# EAGLE board thermo_final (EAGLE 9.6.2)
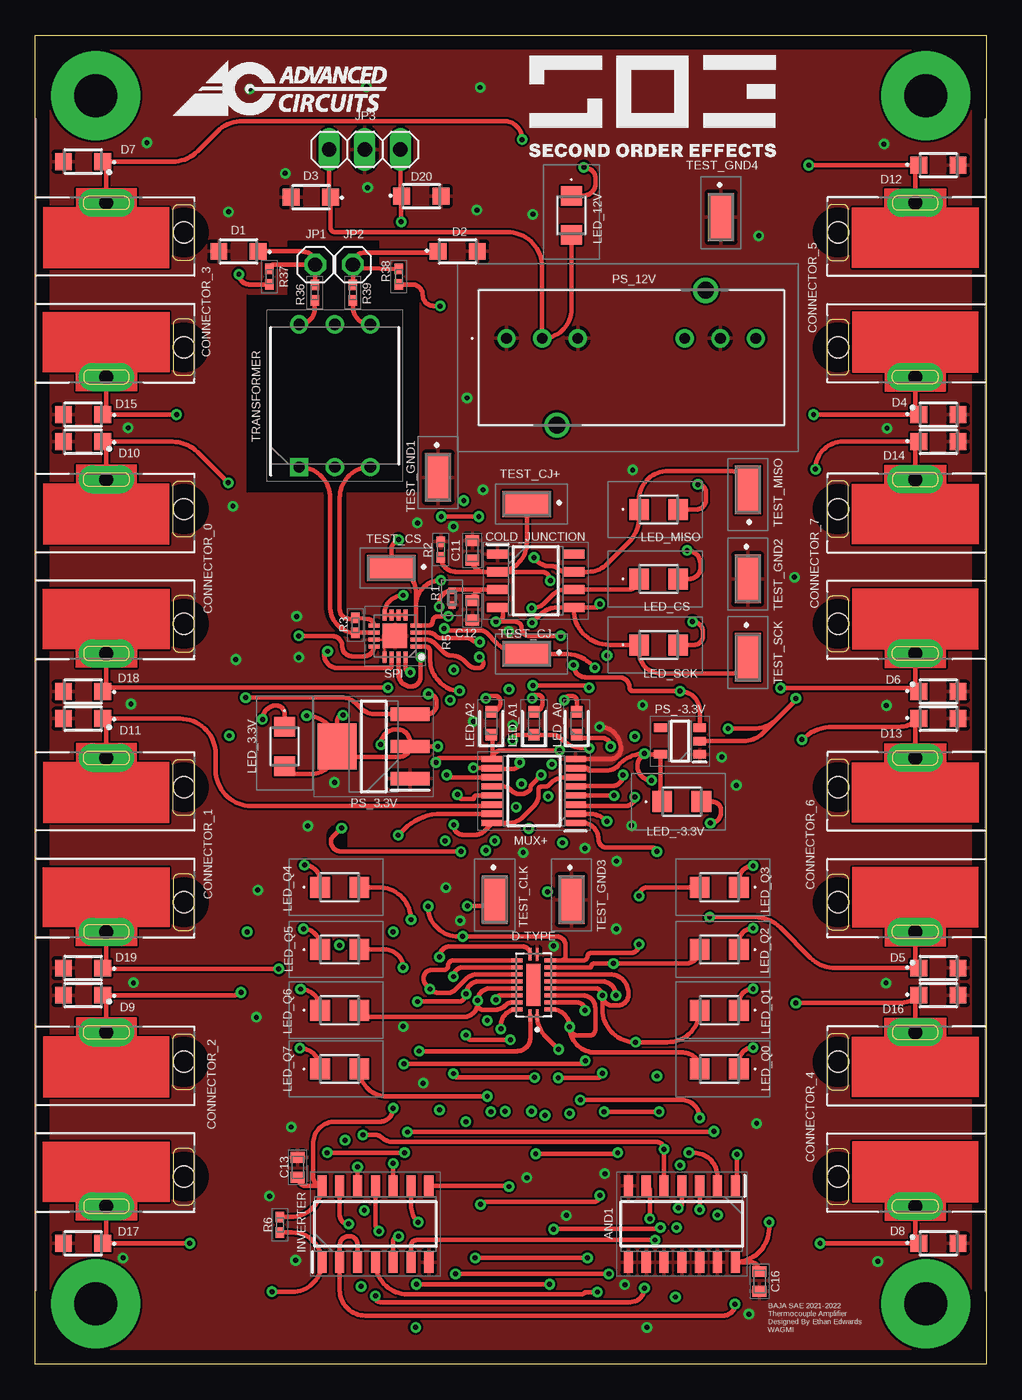
[diagram p2: board, top side]
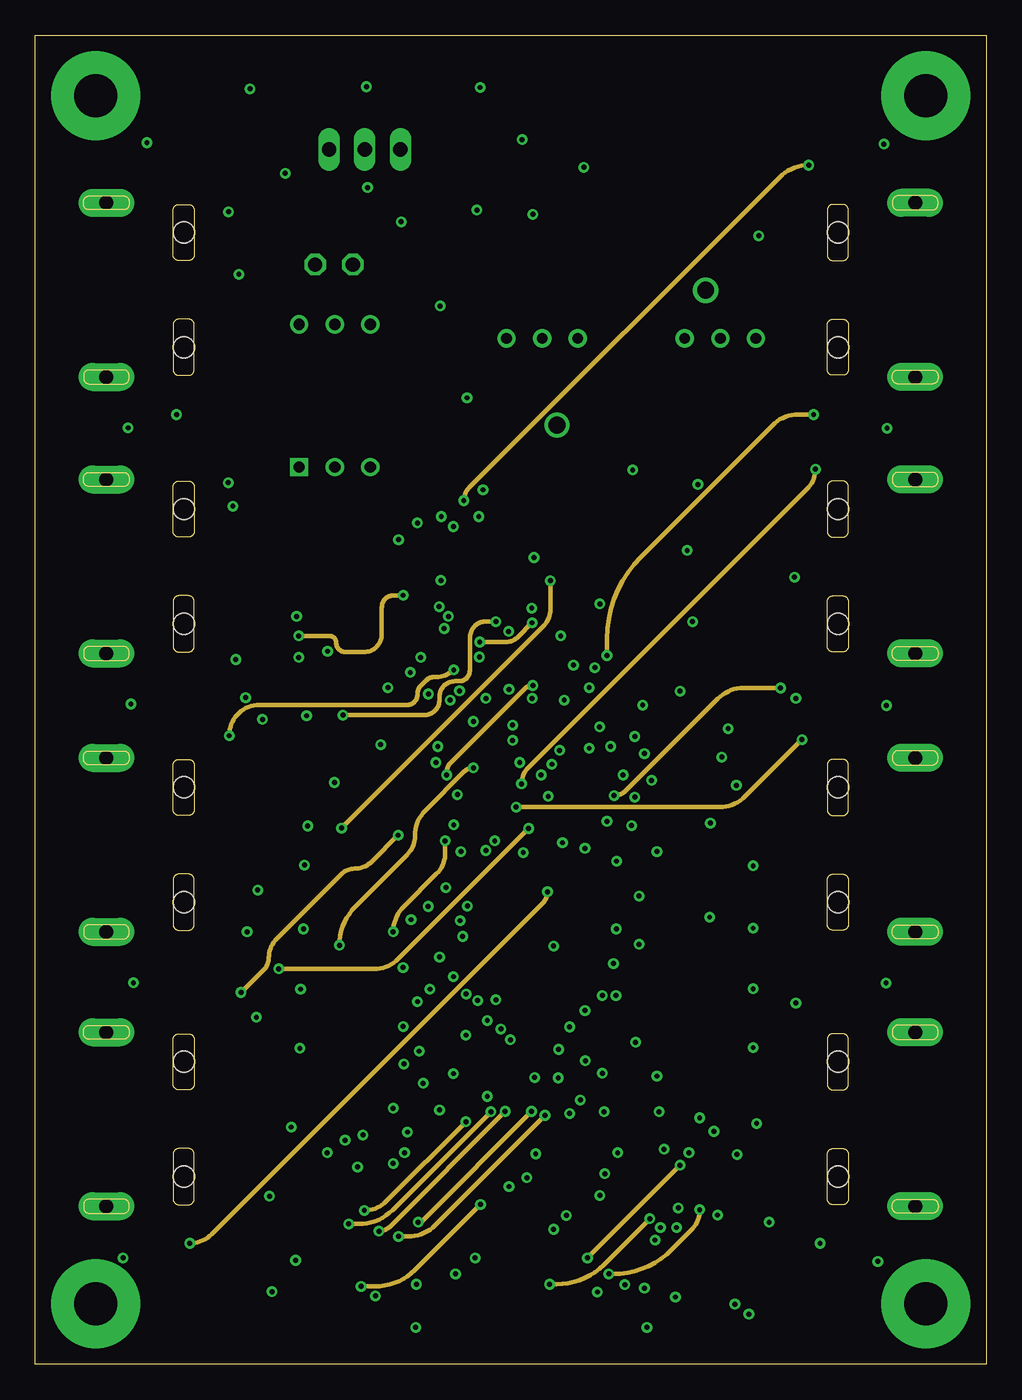
[diagram p3: board, inner layer Route2]
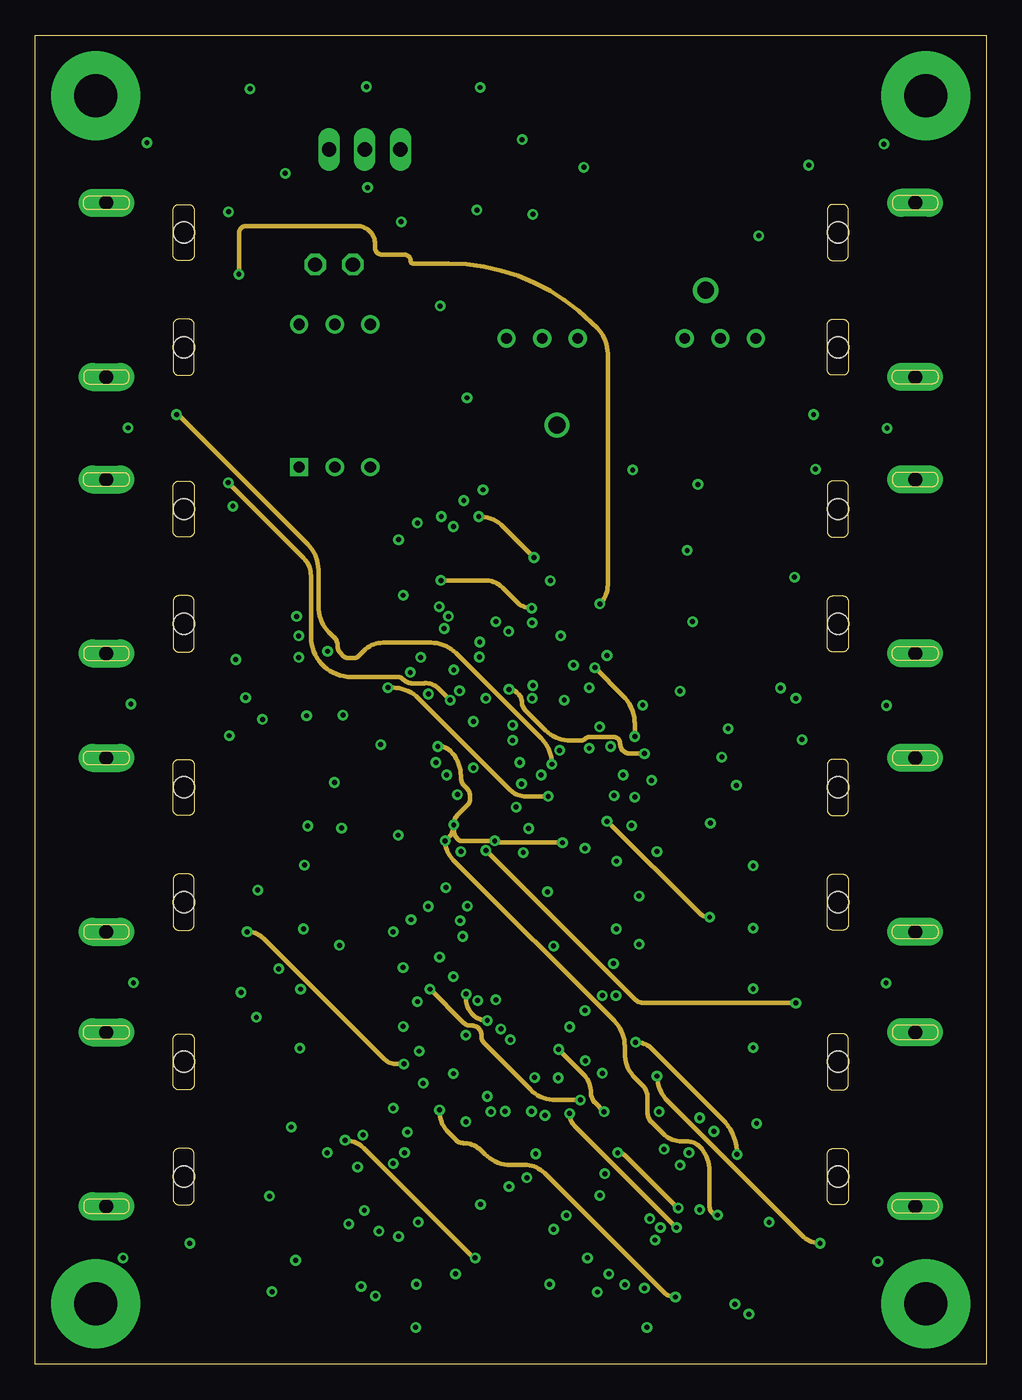
[diagram p4: board, inner layer Route15]
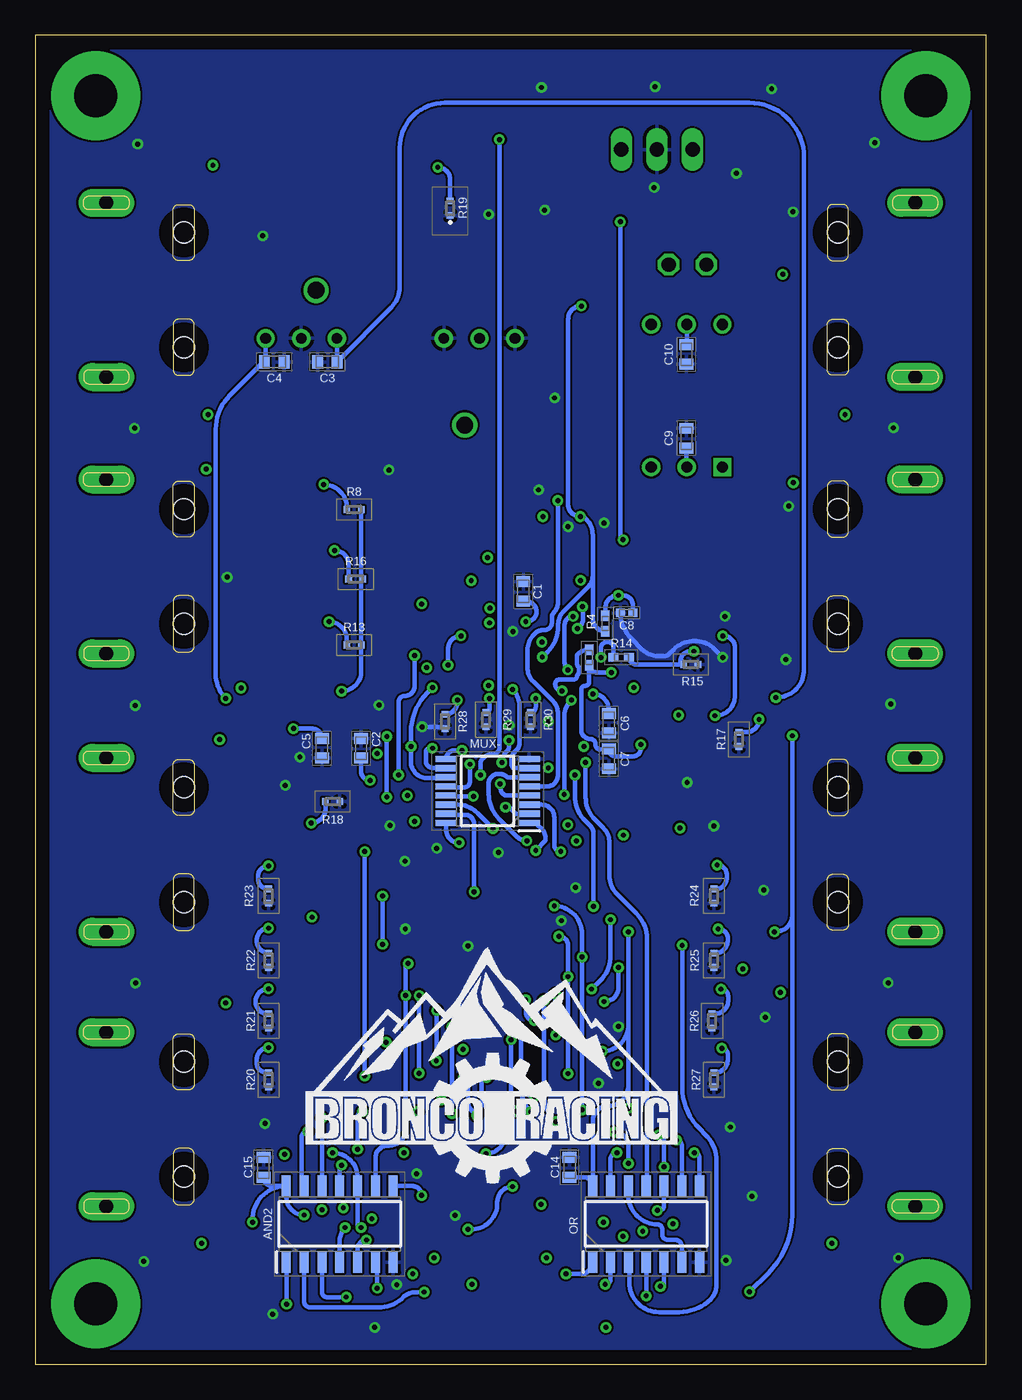
[diagram p5: board, bottom side, seen from below]

Size 67.82 x 94.74 mm. Coordinates in mm from the lower left corner, seen from the top.
Outline: 0,94.74 67.82,94.74 67.82,0 0,0 0,94.74
Copper layers (1+2*15+16): Top 0.035mm / dielectric 0.2mm / Route2 0.0175mm / dielectric 1.065mm / Route15 0.0175mm / dielectric 0.2mm / Bottom 0.035mm
Design rules "default *": minimum track width 6mil, minimum drill 0.35mm, track to track 6mil, track to pad 6mil, pad to pad 6mil, via to via 6mil, smd to smd 6mil, copper to edge 40mil, drill to drill 6mil, minimum pad ring 10mil, minimum via ring 8mil, stop-mask expansion 4mil, vias tented up to drill 20mil, thermal gap 10mil

## Footprints (pad centres in the part's own frame; a part is rotated, then mirrored left to right if it is on the bottom)
SOIC127P600X175-14N = smd 1.525 x 0.65: 1 -2.712,3.81; 2 -2.712,2.54; 3 -2.712,1.27; 4 -2.712,0; 5 -2.712,-1.27; 6 -2.712,-2.54; 7 -2.712,-3.81; 8 2.712,-3.81; 9 2.712,-2.54; 10 2.712,-1.27; 11 2.712,0; 12 2.712,1.27; 13 2.712,2.54; 14 2.712,3.81
CAPC1608X90N = smd 0.78 x 0.99: 1 -0.7,0; 2 0.7,0
CAPC1005X55N = smd 0.65 x 0.62: 1 -0.44,0; 2 0.44,0
SOIC127P600X175-8N = smd 1.525 x 0.65: 1 -2.712,1.905; 2 -2.712,0.635; 3 -2.712,-0.635; 4 -2.712,-1.905; 5 2.712,-1.905; 6 2.712,-0.635; 7 2.712,0.635; 8 2.712,1.905
OMEGA_PCC-SMD-20 = drill 1 pad 2 long: 1 -6.2,0; 2 6.2,0 | hole 1.5: -4.09,5.515; 4.09,5.515
SOD123W = smd 1.2 x 1.2: 1 -1.4,0; 2 1.4,0
QFN50P450X250X100-21N = smd 0.26 x 0.86: 1 -0.25,2.185; 10 -0.25,-2.185; 11 0.25,-2.185; 20 0.25,2.185 | smd 0.86 x 0.26: 2 -1.185,1.75; 3 -1.185,1.25; 4 -1.185,0.75; 5 -1.185,0.25; 6 -1.185,-0.25; 7 -1.185,-0.75; 8 -1.185,-1.25; 9 -1.185,-1.75; 12 1.185,-1.75; 13 1.185,-1.25; 14 1.185,-0.75; 15 1.185,-0.25; 16 1.185,0.25; 17 1.185,0.75; 18 1.185,1.25; 19 1.185,1.75 | smd 1 x 3: 21 0,0
1X01 = drill 1.016 octagon: 1 0,0
1X03 = drill 1.016 long: 1 -2.54,0; 2 0,0; 3 2.54,0
AA3021LSYSKJ3TR = smd 1.4 x 1.5: 1 -1.4,0; 2 1.4,0
APT1608CGCK = smd 0.8 x 0.8: 1 -0.825,0; 2 0.825,0
SOP65P640X120-16N = smd 1.525 x 0.45: 1 -2.962,2.275; 2 -2.962,1.625; 3 -2.962,0.975; 4 -2.962,0.325; 5 -2.962,-0.325; 6 -2.962,-0.975; 7 -2.962,-1.625; 8 -2.962,-2.275; 9 2.962,-2.275; 10 2.962,-1.625; 11 2.962,-0.975; 12 2.962,-0.325; 13 2.962,0.325; 14 2.962,0.975; 15 2.962,1.625; 16 2.962,2.275
SOT230P700X180-4N = smd 2.75 x 0.95: 1 -2.6,2.3; 2 -2.6,0; 3 -2.6,-2.3 | smd 2.75 x 3.25: 4 2.6,0
TMR67212WIR = drill 0.76 pad 1.303: 1 0,0; 2 2.54,0; 3 5.08,0; 6 12.7,0; 7 15.24,0; 8 17.78,0 | drill 1.2 pad 1.8: C1 3.59,-6.175; C2 14.19,3.425
SOT95P280X130-5N = smd 0.9 x 0.6: 1 -1.4,0.95; 2 -1.4,0; 3 -1.4,-0.95; 4 1.4,-0.95; 5 1.4,0.95
ERA2AED122X = smd 0.475 x 0.5: 1 -0.512,0; 2 0.512,0
RESC1005X40N = smd 0.75 x 0.6: 1 -0.55,0; 2 0.55,0
RESC1005X35N = smd 0.7 x 0.6: 1 -0.55,0; 2 0.55,0
ERJ2R_(0402) = smd 0.475 x 0.5: 1 -0.512,0; 2 0.512,0
QFN50P300X300X80-17N = smd 0.8 x 0.3: 1 -1.5,0.75; 2 -1.5,0.25; 3 -1.5,-0.25; 4 -1.5,-0.75; 9 1.5,-0.75; 10 1.5,-0.25; 11 1.5,0.25; 12 1.5,0.75 | smd 0.3 x 0.8: 5 -0.75,-1.5; 6 -0.25,-1.5; 7 0.25,-1.5; 8 0.75,-1.5; 13 0.75,1.5; 14 0.25,1.5; 15 -0.25,1.5; 16 -0.75,1.5 | smd 1.75 x 1.75: 17 0,0
S175146R = smd 3.45 x 1.85: 1 0,0
DIP1016W60P254L914H635Q6N = drill 0.8 pad 1.2 square: 1 -5.08,2.54 | drill 0.8 pad 1.2: 2 -5.08,0; 3 -5.08,-2.54; 4 5.08,-2.54; 5 5.08,0; 6 5.08,2.54
THROUGH_HOLE = drill 3.048 pad 6.35: THROUGH_HOLE 0,0

## Placement (x,y rotation side)
AND1  AND1  [SOIC127P600X175-14N]  46.1,10.01 270 top
AND2  AND2  [SOIC127P600X175-14N]  46.1,10.01 90 bottom
C1  0.1uF  [CAPC1608X90N]  33.02,55.09 270 bottom
C2  1uF  [CAPC1608X90N]  44.58,43.92 90 bottom
C3  4.7uF  [CAPC1608X90N]  46.99,71.45 0 bottom
C4  4.7uF  [CAPC1608X90N]  50.77,71.45 180 bottom
C5  1uF  [CAPC1608X90N]  47.37,43.92 270 bottom
C6  1uF  [CAPC1608X90N]  26.92,45.69 90 bottom
C7  4.7uF  [CAPC1608X90N]  26.92,43.15 90 bottom
C8  0.01uF  [CAPC1005X55N]  25.65,53.57 180 bottom
C9  27pF  [CAPC1608X90N]  21.39,66.01 270 bottom
C10  27pF  [CAPC1608X90N]  21.39,71.98 270 bottom
C11  06035C270JAT2A  [CAPC1608X90N]  31.17,58.01 270 top
C12  06035C270JAT2A  [CAPC1608X90N]  31.17,53.75 270 top
C13  0.1uF  [CAPC1608X90N]  18.72,14.05 270 top
C14  0.1uF  [CAPC1608X90N]  29.72,14.05 270 bottom
C15  0.1uF  [CAPC1608X90N]  51.54,14.05 270 bottom
C16  0.1uF  [CAPC1608X90N]  51.64,5.92 90 top
COLD_JUNCTION  MAX6675ISA+  [SOIC127P600X175-8N]  35.69,55.85 0 top
CONNECTOR_0  PCC-SMD-20  [OMEGA_PCC-SMD-20]  5.08,56.87 270 top
CONNECTOR_1  PCC-SMD-20  [OMEGA_PCC-SMD-20]  5.08,37.03 270 top
CONNECTOR_2  PCC-SMD-20  [OMEGA_PCC-SMD-20]  5.08,17.48 270 top
CONNECTOR_3  PCC-SMD-20  [OMEGA_PCC-SMD-20]  5.08,76.58 270 top
CONNECTOR_4  PCC-SMD-20  [OMEGA_PCC-SMD-20]  62.74,17.48 90 top
CONNECTOR_5  PCC-SMD-20  [OMEGA_PCC-SMD-20]  62.74,76.58 90 top
CONNECTOR_6  PCC-SMD-20  [OMEGA_PCC-SMD-20]  62.74,37.03 90 top
CONNECTOR_7  PCC-SMD-20  [OMEGA_PCC-SMD-20]  62.74,56.87 90 top
D1  PTVS12VS1UR,115  [SOD123W]  14.5,79.32 180 top
D2  PTVS12VS1UR,115  [SOD123W]  30.12,79.32 0 top
D3  PTVS12VS1UR,115  [SOD123W]  19.66,83.19 180 top
D4  PTVS12VS1UR,115  [SOD123W]  64.39,67.69 0 top
D5  PTVS12VS1UR,115  [SOD123W]  64.39,28.24 0 top
D6  PTVS12VS1UR,115  [SOD123W]  64.39,47.96 0 top
D7  PTVS12VS1UR,115  [SOD123W]  3.43,85.72 180 top
D8  PTVS12VS1UR,115  [SOD123W]  64.39,8.64 0 top
D9  PTVS12VS1UR,115  [SOD123W]  3.43,26.31 180 top
D10  PTVS12VS1UR,115  [SOD123W]  3.43,65.76 180 top
D11  PTVS12VS1UR,115  [SOD123W]  3.43,46.02 180 top
D12  PTVS12VS1UR,115  [SOD123W]  64.39,85.47 0 top
D13  PTVS12VS1UR,115  [SOD123W]  64.39,46.02 0 top
D14  PTVS12VS1UR,115  [SOD123W]  64.39,65.76 0 top
D15  PTVS12VS1UR,115  [SOD123W]  3.43,67.69 180 top
D16  PTVS12VS1UR,115  [SOD123W]  64.39,26.31 0 top
D17  PTVS12VS1UR,115  [SOD123W]  3.43,8.64 180 top
D18  PTVS12VS1UR,115  [SOD123W]  3.43,47.96 180 top
D19  PTVS12VS1UR,115  [SOD123W]  3.43,28.24 180 top
D20  PTVS12VS1UR,115  [SOD123W]  27.53,83.26 0 top
D-TYPE  D-type  [QFN50P450X250X100-21N]  35.53,27.05 180 top
INVERTER  INVERTER  [SOIC127P600X175-14N]  24.26,10.01 90 top
JP1  [1X01]  19.96,78.38 0 top
JP2  [1X01]  22.66,78.38 0 top
JP3  [1X03]  23.5,86.59 0 top
LED_3.3V  AA3021LSYSK_J3-TR  [AA3021LSYSKJ3TR]  17.78,44.04 270 top
LED_12V  AA3021LSYSK_J3-TR  [AA3021LSYSKJ3TR]  38.23,81.89 270 top
LED_-3.3V  AA3021LSYSK_J3-TR  [AA3021LSYSKJ3TR]  46.1,40.11 0 top
LED_A0  APTD1608LCGCK  [APT1608CGCK]  38.61,45.69 90 top
LED_A1  APTD1608LCGCK  [APT1608CGCK]  35.56,45.69 90 top
LED_A2  APTD1608LCGCK  [APT1608CGCK]  32.51,45.69 90 top
LED_CS  AA3021LSYSK_J3-TR  [AA3021LSYSKJ3TR]  44.45,55.98 0 top
LED_MISO  AA3021LSYSK_J3-TR  [AA3021LSYSKJ3TR]  44.45,60.93 0 top
LED_Q0  AA3021LSYSK_J3-TR  [AA3021LSYSKJ3TR]  48.77,21.06 180 top
LED_Q1  AA3021LSYSK_J3-TR  [AA3021LSYSKJ3TR]  48.77,25.25 180 top
LED_Q2  AA3021LSYSK_J3-TR  [AA3021LSYSKJ3TR]  48.77,29.57 180 top
LED_Q3  AA3021LSYSK_J3-TR  [AA3021LSYSKJ3TR]  48.77,34.01 180 top
LED_Q4  AA3021LSYSK_J3-TR  [AA3021LSYSKJ3TR]  21.72,34.01 0 top
LED_Q5  AA3021LSYSK_J3-TR  [AA3021LSYSKJ3TR]  21.72,29.57 0 top
LED_Q6  AA3021LSYSK_J3-TR  [AA3021LSYSKJ3TR]  21.72,25.25 0 top
LED_Q7  AA3021LSYSK_J3-TR  [AA3021LSYSKJ3TR]  21.72,21.06 0 top
LED_SCK  AA3021LSYSK_J3-TR  [AA3021LSYSKJ3TR]  44.45,51.28 0 top
MUX+  DG4051EEQ-T1-GE3  [SOP65P640X120-16N]  35.56,40.87 180 top
MUX-  DG4051EEQ-T1-GE3  [SOP65P640X120-16N]  35.56,40.87 180 bottom
OR  OR  [SOIC127P600X175-14N]  24.26,10.01 90 bottom
PS_3.3V  LDL1117S33R  [SOT230P700X180-4N]  24.13,44.04 180 top
PS_12V  TMR_6-2422WIR  [TMR67212WIR]  33.6,73.13 0 top
PS_-3.3V  XC6901D331MR-G  [SOT95P280X130-5N]  45.97,44.42 180 top
R1  5.6K  [ERA2AED122X]  29.72,54.64 270 top
R2  CRG0402ZR  [RESC1005X40N]  28.93,58.09 90 top
R3  100  [RESC1005X40N]  22.83,52.68 270 top
R4  3.3K  [RESC1005X40N]  27.18,52.81 90 bottom
R5  3.3K  [RESC1005X40N]  28.32,50.39 90 bottom
R6  RC0402FR-0793K1L  [RESC1005X40N]  17.45,9.96 270 top
R8  ERA-2ARB562X  [ERA2AED122X]  45.09,60.93 180 bottom
R13  ERA-2ARB562X  [ERA2AED122X]  45.09,51.28 180 bottom
R14  1.21K  [RESC1005X35N]  26.04,50.39 0 bottom
R15  787  [ERA2AED122X]  21.08,49.89 0 bottom
R16  ERA-2ARB562X  [ERA2AED122X]  44.96,55.98 180 bottom
R17  ERA-2ARB562X  [ERA2AED122X]  17.65,44.55 90 bottom
R18  ERA-2ARB562X  [ERA2AED122X]  46.61,40.11 180 bottom
R19  ERJ-2RKF2002X  [ERJ2R_(0402)]  38.23,82.4 90 bottom
R20  ERA-2ARB562X  [ERA2AED122X]  51.18,20.29 90 bottom
R21  ERA-2ARB562X  [ERA2AED122X]  51.18,24.49 90 bottom
R22  ERA-2ARB562X  [ERA2AED122X]  51.18,28.8 90 bottom
R23  ERA-2ARB562X  [ERA2AED122X]  51.18,33.38 90 bottom
R24  ERA-2ARB562X  [ERA2AED122X]  19.43,33.38 90 bottom
R25  ERA-2ARB562X  [ERA2AED122X]  19.43,28.8 90 bottom
R26  ERA-2ARB562X  [ERA2AED122X]  19.56,24.49 90 bottom
R27  ERA-2ARB562X  [ERA2AED122X]  19.43,20.29 90 bottom
R28  ERA-2ARB562X  [ERA2AED122X]  38.61,45.82 90 bottom
R29  ERA-2ARB562X  [ERA2AED122X]  35.69,45.95 90 bottom
R30  ERA-2ARB562X  [ERA2AED122X]  32.51,45.95 90 bottom
R36  CRG0402ZR  [RESC1005X40N]  19.94,76.38 270 top
R37  CRG0402ZR  [RESC1005X40N]  16.71,77.52 270 top
R38  CRG0402ZR  [RESC1005X40N]  25.93,77.52 270 top
R39  CRG0402ZR  [RESC1005X40N]  22.66,76.38 90 top
SPI  LTC6820IUD#PBF  [QFN50P300X300X80-17N]  25.65,51.92 180 top
TEST_CJ+  S1751-46R  [S175146R]  35.05,61.32 0 top
TEST_CJ-  S1751-46R  [S175146R]  35.05,50.65 0 top
TEST_CLK  S1751-46R  [S175146R]  32.77,33.12 90 top
TEST_CS  S1751-46R  [S175146R]  25.4,56.74 0 top
TEST_GND1  S1751-46R  [S175146R]  28.73,63.22 90 top
TEST_GND2  S1751-46R  [S175146R]  50.8,55.98 90 top
TEST_GND3  S1751-46R  [S175146R]  38.23,33.12 90 top
TEST_GND4  S1751-46R  [S175146R]  48.9,81.76 90 top
TEST_MISO  S1751-46R  [S175146R]  50.8,62.33 270 top
TEST_SCK  S1751-46R  [S175146R]  50.8,50.39 90 top
TRANSFORMER  782482_33VC  [DIP1016W60P254L914H635Q6N]  21.36,69.04 90 top
U$1  THROUGH_HOLE  [THROUGH_HOLE]  4.32,90.42 0 top
U$2  THROUGH_HOLE  [THROUGH_HOLE]  4.32,4.32 0 top
U$3  THROUGH_HOLE  [THROUGH_HOLE]  63.5,4.32 0 top
U$4  THROUGH_HOLE  [THROUGH_HOLE]  63.5,90.42 0 top

## Tracks (layer width: path | path; a pad name or v marks a point on that pad's centre or on a via)
!CS  (via drill 0.35)
  Top 0.305: v49.89,4.29 arc-90 49.07,3.48 23.52,3.48 arc-90 21.72,5.28 INVERTER.2 21.72,8.48 arc-90 22.38,9.14 arc-90 22.99,8.53 INVERTER.3
  Bottom 0.305: v49.89,4.29 49.89,7.27 arc-90 AND2.1
!CS2  (via drill 0.35)
  Top 0.305: v40.08,5.16 39.29,5.16 arc45 39.17,5.11 arc-45 38.92,5 26.55,5 arc-90 INVERTER.4
  Bottom 0.305: AND2.2 48.64,4.5 arc-90 48.21,4.06 43.34,4.06 arc-45 41.55,4.81 arc45 40.71,5.16 v40.08,5.16
!Q1  (via drill 0.35)
  Top 0.305: INVERTER.6 26.8,8.48 arc-90 27.18,8.87 v44.2,8.87
  Bottom 0.305: v44.2,8.87 arc-90 44.83,8.23 AND2.5
!Q3  (via drill 0.35)
  Top 0.305: v33.78,12.68 33.74,12.72 INVERTER.8 | AND1.2 48.64,13.38 arc90 46.93,15.09 v46.61,15.09 | v44.58,9.75 arc-45 44.33,9.65 36.98,9.65 v36.96,9.63
  Bottom 0.305: v33.78,12.68 arc-90 34.87,11.58 34.87,11.48 arc90 36.73,9.63 v36.96,9.63 | v46.61,15.09 arc90 44.83,13.31 AND2.10 44.83,10.01 arc-90 v44.58,9.75
!Q5  (via drill 0.35)
  Top 0.305: v25.53,14.33 INVERTER.10 | v48.39,16.61 48.34,16.56 v26.54,16.56
  Bottom 0.305: v48.39,16.61 arc-90 48.82,16.18 48.82,12.9 AND2.13 | v26.54,16.56 arc90 25.53,15.54 v25.53,14.33
!Q7  (via drill 0.35)
  Top 0.305: AND1.5 v44.83,15.34 arc90 44.32,15.85 25.52,15.85 arc-45 24.66,16.2 arc45 24.3,16.36 v23.37,16.36 | v22.99,14.07 INVERTER.12 | v44.48,18.01 v40.56,18.01 | v37.31,22.45 36.41,23.36 arc-45 D-TYPE.1
  Route15 0.305: v40.56,18.01 39.91,18.66 arc-45 39.62,19.36 arc45 39.07,20.7 v37.31,22.45
  Bottom 0.305: v44.83,15.34 44.83,17.65 arc90 v44.48,18.01 | v23.37,16.36 arc90 22.99,15.98 v22.99,14.07
-VCC  (via drill 0.35)
  Top 0.305: PS_-3.3V.5 43.75,43.48 arc90 42.93,42.65 arc90 v43.94,41.63 | PS_-3.3V.5 44.57,40.41 arc45 LED_-3.3V.1 | PS_-3.3V.5 43.49,43.48 v43.43,43.54 arc45 41.7,42.82 41.53,42.65 arc-45 40.79,42.34 39.5,42.34 arc-90 39.42,42.42 arc90 39.34,42.49 MUX+.7
  Route15 0.305: v33.78,48.11 33.83,48.11 arc-45 34.31,47.9 34.48,47.74 arc-45 34.7,47.22 arc45 34.93,46.66 36.4,45.19 arc45 38.18,44.45 38.89,44.45 arc45 39.19,44.58 arc-45 39.56,44.73 41.2,44.73 arc-90 41.71,44.22 arc90 42.39,43.54 v43.43,43.54
  Bottom 0.305: v43.94,41.63 arc90 44.58,42.27 C2.1 | MUX-.7 33.73,42.49 arc45 33.86,42.8 33.86,43.08 arc45 33.61,43.69 33.45,43.84 arc-45 33.3,44.21 33.3,46.94 arc-45 v33.78,48.11
A1  (via drill 0.35)
  Top 0.305: v34.54,42.9 arc-90 34.09,42.44 32.6,42.44 32.57,42.48 | v34.04,44.48 arc-90 34.43,44.87 LED_A1.1 36.93,44.87 arc-45 37.39,44.68 37.47,44.6 arc45 39.05,43.94 39.44,43.94 arc-45 v39.5,43.92 | MUX+.10 arc45 32.64,42.48 32.57,42.48 | v31.24,42.52 32.52,42.52 arc90 32.57,42.48
  Route2 0.305: v31.24,42.52 arc45 30.59,42.25 27.82,39.48 arc45 27.08,37.68 27.08,37.67 arc-45 26.52,36.32 22.84,32.65 arc45 v21.69,29.87
  Bottom 0.305: v21.69,29.87 21.69,19.76 arc-45 20.47,16.82 20,16.34 arc45 19.25,14.54 19.25,5.63 arc45 19.66,4.65 arc45 21.88,3.73 23.37,3.73 arc90 25.45,5.82 25.45,7.22 arc-90 OR.3 | v34.04,44.48 34.04,44.01 arc45 34.14,43.76 34.22,43.68 arc-45 v34.54,42.9 | MUX-.10 39.36,42.49 arc45 39.85,42.7 arc45 39.95,42.94 39.95,43.64 arc90 39.67,43.92 v39.5,43.92
A2  (via drill 0.35)
  Top 0.305: MUX+.9 32.6,44.78 arc90 LED_A2.1 | MUX+.9 arc-90 33.22,43.76 v37.39,43.76 | v28.57,42.9 arc-90 28.89,43.22 32.41,43.22 arc-45 MUX+.9
  Bottom 0.305: v37.39,43.76 37.9,43.76 arc-90 MUX-.9 | v28.57,42.9 28.57,40.42 arc-45 27.92,38.84 27.3,38.23 arc45 26.87,37.19 26.87,34.82 arc-45 26.34,33.53 24.95,32.14 arc45 24.21,30.34 24.21,12.84 arc45 OR.11
CJ+  (via drill 0.35)
  Top 0.305: v39.9,49.66 39.73,49.84 arc45 37.76,50.65 35.2,50.65 TEST_CJ-.1 34.73,50.65 arc-45 32.94,51.39 32.18,52.15 arc45 31.81,52.3 29.53,52.3 arc-45 v29.16,52.45 | MUX+.3 arc90 38.61,39.8 42.11,39.8 arc90 v42.75,40.44 | v28.8,54 28.8,54.23 arc-90 R1.1 arc-90 29.79,55.22 COLD_JUNCTION.3 31.94,55.22 arc90 C12.1
  Route15 0.305: v42.75,44.76 42.75,45.63 arc45 41.91,47.65 v39.9,49.66
  Bottom 0.305: v42.75,44.76 v42.75,40.44 | v29.16,52.45 28.97,52.64 arc-45 28.75,53.16 28.75,53.95 arc-90 v28.8,54
CJ-  (via drill 0.35)
  Top 0.305: v30.35,36.55 21.82,36.55 arc-90 21.08,37.29 arc-45 21.21,37.59 v21.84,38.23 | v36.73,55.85 arc90 36.09,56.49 COLD_JUNCTION.2 | COLD_JUNCTION.2 arc90 35.05,58.57 TEST_CJ+.1 | COLD_JUNCTION.2 29.98,56.49 arc-90 R2.1 | COLD_JUNCTION.2 31.99,56.49 arc-90 C11.2
  Route2 0.305: v21.84,38.23 36.22,52.6 arc45 36.73,53.84 v36.73,55.85
  Bottom 0.305: MUX-.3 31.71,39.89 arc90 30.81,38.99 30.81,37.01 arc-90 v30.35,36.55
CLK  (via drill 0.35)
  Top 0.305: TEST_CLK.1 32.77,32.74 arc-90 32.69,32.66 v30.81,32.66 | v28.83,29.03 arc-90 29.59,29.79 34.73,29.79 arc-90 D-TYPE.11
  Route15 0.305: v45.64,4.8 arc-45 44.78,5.16 36.3,13.64 arc45 34.89,14.22 33.87,14.22 arc-45 32.07,14.97 31.79,15.25 arc45 30.53,15.77 arc-45 30.01,15.99 29.44,16.56 arc-45 28.83,18.03 v28.83,18.14
  Bottom 0.305: AND2.3 47.37,5.18 arc-90 46.97,4.78 45.7,4.78 arc-45 v45.64,4.8 | v28.83,18.14 v28.83,29.03 28.83,30.68 arc-90 v30.81,32.66
CS  (via drill 0.35)
  Top 0.305: LED_CS.1 arc-90 42.29,55.22 COLD_JUNCTION.6 37.8,55.22 arc45 36.88,54.84 36.31,54.27 arc-45 v35.41,53.89 | v16.89,5.18 18.33,5.18 arc90 INVERTER.1 arc90 18.34,9.41 R6.2 | v29.46,53.31 28.7,53.31 arc90 28.35,52.96 arc-90 28.05,52.67 SPI.4 27.15,54.13 | 27.15,54.13 27.15,54.99 arc90 TEST_CS.1 25.4,58.14 arc-90 25.91,58.65 v25.91,58.78 | D20.1 26.1,83.23 | 26.1,83.23 26.02,83.15 arc90 26.04,83.16 JP3.3 | v26.1,81.44 26.1,83.23 | v26.29,21.41 38.99,21.41 arc90 v39.22,21.64 | v39.19,25.22 arc90 38.61,25.8 D-TYPE.3 | 27.15,54.13 arc-90 28.91,55.88 v28.93,55.88
  Route2 0.305: v13.84,44.81 13.84,44.86 arc-90 15.98,46.99 26.49,46.99 arc90 27.25,47.75 arc-45 27.52,48.4 27.87,48.74 arc-45 28.47,49 28.62,49 arc45 v29.84,49.51
  Route15 0.305: v15.11,30.84 arc-45 16.28,30.35 24.83,21.81 arc45 25.78,21.41 v26.29,21.41 | v35.41,53.89 arc-45 34.34,54.34 33.3,55.37 arc45 32.07,55.88 v28.93,55.88
  Bottom 0.305: v16.89,5.18 15.56,6.51 arc-45 13.84,10.66 13.84,32.03 | 13.84,32.03 v13.84,44.81 | v29.84,49.51 arc45 30.07,50.06 30.07,52.7 arc90 v29.46,53.31 | 13.84,32.03 arc90 15.04,30.84 v15.11,30.84 | v25.91,58.78 arc90 26.1,58.97 v26.1,81.44 | v39.22,21.64 39.22,25.2 arc90 v39.19,25.22
GND  (via drill 0.35)
  Top 0.152: SPI.13 24.9,51.58 25.02,51.69 | SPI.11 25.4,51.67 SPI.17
  Top 0.305: 25.02,51.69 25.43,51.69 arc90 SPI.17 arc-90 25.4,51.67 | MUX+.8 40.98,43.14 arc90 41.76,43.92 arc90 v40.23,45.44
  Bottom 0.305: C8.2 C8.2 arc-45 25.35,51.77 24.51,50.93 arc-45 23.47,50.49 22.94,50.49 arc-45 22.63,50.62 22.3,50.96 arc45 20.83,51.57 arc45 19.36,50.96 v18.8,50.39 | v40.23,45.44 38.74,45.44 arc90 R28.1
  other vias: 34.04,45.57 31.24,45.82 42.04,5.69 30.78,68.88 42.6,63.75 51.59,80.44 31.5,82.27 35.48,81.97 23.7,83.87 17.83,84.89 13.79,82.14 14.1,61.16 27.25,59.97 31.93,62.33 54.13,56.11 48.95,43.28 49.99,41.27 41.45,35.86 41.43,31.04 51.44,17.17 50.88,3.58 40.61,13.59 35.05,13.31 37.87,10.62 18.57,7.42 16.71,11.99 18.26,16.92 27.66,20.04 15.77,24.74 15.88,33.81 19.43,38.38 6.83,47.07 14.3,50.24 18.64,53.31 42.52,38.4 39.19,36.78 26.24,24.08 30.3,31.62 29.29,33.99 34.8,36.47 43.31,46.99 29.82,59.72 15.32,90.91 23.62,91.06 31.72,91.01 60.5,86.97 60.07,7.34 60.66,27.18 60.68,46.96 60.73,66.73 7.98,87.07 6.63,66.75 43.61,2.64 7.01,27.2 6.27,7.59 21.34,41.48 36.96,29.82 33.76,52.25
  pour Top (isolate 0): -5.92,101.4 -5.92,-1.55 71.63,-1.55 71.63,101.37
  pour Bottom (isolate 0): -7.14,95.73 -7.14,-2.82 72.67,-2.82 72.67,101.78 -7.19,101.78 -7.19,95.73
  cutout Top: 15.14,62.2 15.14,76.17 27.3,76.17 27.3,62.2
  cutout Top (isolate 0.178): 33.68,56.72 36.22,56.72 arc-90 36.86,56.08 36.86,55.91 arc-90 36.63,55.68 36.58,55.68 arc-90 36.4,55.85 arc90 35.99,56.26 33.83,56.26 arc-90 33.68,56.41
  cutout Top (isolate 0.178): 21.74,36.35 arc-90 20.8,37.29 20.8,37.67 arc-90 21.62,38.48 arc-90 22.2,37.9 22.2,36.78 30.43,36.78 arc-90 30.63,36.58 30.63,36.5 arc-90 30.48,36.35
  cutout Bottom (isolate 0.178): 31.9,40.06 31.62,40.06 arc90 30.61,39.04 30.61,36.96 arc-90 30.43,36.78 30.38,36.78 arc90 30.2,36.6 30.2,36.5 arc90 30.38,36.32 30.43,36.32 arc90 31.01,36.91 31.01,38.96 arc-90 31.67,39.62 31.88,39.62 arc90 31.98,39.73 31.98,39.98 arc90
  cutout Top (isolate 0.635): 18.87,63.5 arc-90 20.6,61.77 20.6,54.05 arc90 22.86,51.79 24.66,51.79 24.66,52.81 arc90 24.36,53.11 22.71,53.11 arc-90 22.17,53.64 22.17,61.87 arc-90 23.9,63.6 24.13,63.6 arc90 24.26,63.73 24.26,64.16 arc90 24.08,64.34 18.62,64.34 arc90 18.52,64.24 18.52,63.58 arc90 18.59,63.5
  cutout Top (isolate 0.635): 18.06,76.2 18.06,80.04 24.46,80.04 24.46,76.2
  cutout Top: 33.81,56.26 29.87,56.26 arc-90 28.7,57.43 28.7,57.61 arc-90 28.88,57.78 29.06,57.78 arc-90 29.18,57.66 29.18,57.56 arc90 30.02,56.72 33.73,56.72 arc-90 33.81,56.64
IM
  Top 0.305: TRANSFORMER.3 arc90 21.72,61.77 21.72,53.82 arc90 22.4,53.14 R3.1 23.68,53.14 arc-90 SPI.9
IMOUT
  Top 0.305: R39.1 22.66,75.36 arc90 TRANSFORMER.4
IP
  Top 0.305: TRANSFORMER.1 arc-90 21.03,61.75 21.03,54.03 arc90 R3.2 | R3.2 arc-90 22.89,52.17 | SPI.10 22.89,52.17 | 22.89,52.17 arc-90 R3.2
IPOUT
  Top 0.305: R36.2 19.94,75.23 arc-90 TRANSFORMER.6
MISO  (via drill 0.35)
  Top 0.305: TEST_MISO.1 arc90 49.45,63.68 45.11,63.68 arc90 43.05,61.62 LED_MISO.1 43.05,60.31 arc-45 42.36,58.64 40.77,57.05 arc-45 39.42,56.49 COLD_JUNCTION.7 37.77,56.49 arc-45 37.34,56.67 arc45 36.79,56.9 36.6,56.9 arc-45 35.86,57.2 v35.56,57.51 | v28.96,60.43 v31.62,60.43 | v28.88,75.44 28.4,75.44 arc-90 27.64,76.2 arc90 26.86,76.97 R38.2 | v31.67,50.42 31.83,50.26 arc-45 31.95,49.96 arc-90 31.62,49.63 31.6,49.63 31.44,49.63 arc-45 30.89,49.86 30.62,50.12 arc45 29.67,50.52 arc-45 29.15,50.74 28.5,51.38 arc45 27.82,51.67 SPI.2
  Route15 0.305: v31.62,60.43 arc-45 33.36,59.71 v35.56,57.51
  Bottom 0.305: R4.1 arc90 28.07,53.15 28.07,56.16 | 28.07,56.16 28.07,59.11 arc-45 28.54,60.26 arc-45 v28.96,60.43 arc90 29.82,61.29 29.82,74.5 arc90 v28.88,75.44 | 28.07,56.16 arc45 28.35,55.47 30.16,53.66 arc-45 30.53,52.76 30.53,52.61 arc45 31.27,50.81 v31.67,50.42
N$2  (via drill 0.35)
  Top 0.305: LED_12V.1 39.07,83.29 arc90 39.95,84.18 39.95,84.48 arc90 v39.12,85.32
  Bottom 0.305: v39.12,85.32 arc90 38.23,84.43 R19.2
N$4  (via drill 0.35)
  other vias: 27.13,2.64
N$5  (via drill 0.35)
  Top 0.305: SPI.14 25.4,49.74 arc-90 25.3,49.63 21.57,49.63 arc-90 20.61,50.58 arc-90 v20.85,50.83
  Bottom 0.305: R14.2 arc-90 24.98,49.89 R15.1 arc90 21.82,50.11 arc90 21.11,50.83 v20.85,50.83
N$7  (via drill 0.35)
  Top 0.305: LED_Q0.1 50.17,21.57 arc-90 v51.18,22.58
  Bottom 0.305: v51.18,22.58 arc-90 52.02,21.74 52.02,21.49 arc-90 51.34,20.81 R20.2
N$10
  Bottom 0.305: C9.2 21.39,63.98 arc-90 TRANSFORMER.2
N$11  (via drill 0.35)
  Top 0.305: SPI.15 25.9,49.2 arc90 26.8,48.31 arc90 27.48,49 v27.48,50.39
  Bottom 0.305: R14.1 26.59,51.26 arc-45 26.59,51.28 26.65,51.34 arc-45 27.01,51.49 27.01,51.49 arc-45 27.38,51.33 arc-45 27.48,51.09 v27.48,50.39
N$12  (via drill 0.35)
  Top 0.305: LED_Q1.1 50.17,25.76 arc-90 v51.18,26.77
  Bottom 0.305: v51.18,26.77 arc-90 52.09,25.86 52.09,25.83 arc-90 51.26,25 R21.2
N$14
  Bottom 0.305: C10.1 arc-90 21.36,72.71 TRANSFORMER.5
N$16  (via drill 0.35)
  Top 0.305: LED_Q2.1 50.17,30.08 arc-90 v51.18,31.09
  Bottom 0.305: v51.18,31.09 arc-90 52.02,30.25 52.02,30.18 arc-90 51.18,29.34 R22.2
N$17  (via drill 0.35)
  Top 0.305: LED_Q3.1 50.17,34.52 arc-90 v51.18,35.53
  Bottom 0.305: v51.18,35.53 arc-90 51.92,34.8 51.92,34.62 arc-90 R23.2
N$20  (via drill 0.35)
  Top 0.305: LED_MISO.2 47.14,60.94 arc90 47.83,61.62 47.83,62.13 arc90 v47.24,62.71
  Bottom 0.305: v47.24,62.71 arc90 45.6,61.07 R8.2
N$22  (via drill 0.35)
  Top 0.305: SPI.1 27.8,51.17 arc-90 28.17,50.8 28.17,50.12 arc45 28.73,48.77 28.95,48.55 arc45 v30.25,48.01
  Bottom 0.305: v30.25,48.01 arc90 30.75,48.5 arc90 30.44,48.81 29.48,48.81 arc-90 29.18,49.1 arc-45 29.06,49.41 29.06,49.68 arc45 29.21,50.05 29.21,50.55 29.16,50.6 arc45 R5.2
N$23  (via drill 0.35)
  Top 0.305: LED_SCK.2 46.99,51.28 arc90 47.6,51.89 47.6,52.2 arc90 v46.86,52.93
  Bottom 0.305: v46.86,52.93 arc90 45.6,51.67 R13.2
N$24  (via drill 0.35)
  Top 0.305: LED_CS.2 46.63,55.98 arc90 47.42,56.77 47.42,57.07 arc90 v46.48,58.01
  Bottom 0.305: v46.48,58.01 arc90 45.47,57 R16.2
N$25  (via drill 0.35)
  Top 0.305: LED_3.3V.1 17.78,46.38 arc90 17.2,46.97 arc90 v16.2,45.97
  Bottom 0.305: v16.2,45.97 arc90 17.12,45.06 R17.2
N$26  (via drill 0.35)
  Top 0.305: LED_-3.3V.2 48.28,40.11 arc-90 48.9,39.5 48.9,39.34 arc-90 v48.13,38.58
  Bottom 0.305: v48.13,38.58 arc-90 47.12,39.59 R18.2
N$27  (via drill 0.35)
  Top 0.305: v19.2,35.59 arc-90 20.32,34.47 LED_Q4.1
  Bottom 0.305: R24.2 19.3,33.89 arc-90 18.52,34.67 18.52,34.9 arc-90 v19.2,35.59
N$28  (via drill 0.35)
  Top 0.305: v19.13,31.04 arc-90 20.32,29.85 LED_Q5.1
  Bottom 0.305: v19.13,31.04 arc90 18.44,30.35 18.44,30.23 arc90 19.35,29.32 R25.2
N$29  (via drill 0.35)
  Top 0.305: v18.92,26.75 arc-90 20.32,25.35 LED_Q6.1
  Bottom 0.305: R26.2 19.32,25 arc-90 18.41,25.91 18.41,26.24 arc-90 v18.92,26.75
N$30  (via drill 0.35)
  Top 0.305: v18.87,22.53 arc-90 20.32,21.09 LED_Q7.1
  Bottom 0.305: R27.2 19.35,20.81 arc-90 18.44,21.72 18.44,22.1 arc-90 v18.87,22.53
N$34  (via drill 0.35)
  Top 0.305: LED_A0.2 38.61,47.32 arc90 38.3,47.62 38,47.62 arc90 v37.72,47.35
  Bottom 0.305: v37.72,47.35 37.72,47.22 arc90 R28.2
N$35  (via drill 0.35)
  Top 0.305: LED_A1.2 arc90 36.17,47.13 36.17,47.42 arc90 35.89,47.7 35.66,47.7 arc90 v35.43,47.47
  Bottom 0.305: v35.43,47.47 35.43,46.72 arc90 R29.2
N$36  (via drill 0.35)
  Top 0.305: LED_A2.2 arc90 33.17,47.18 33.17,47.24 arc90 32.77,47.65 32.31,47.65 arc90 v32.13,47.47
  Bottom 0.305: v32.13,47.47 32.13,46.84 arc90 R30.2
N$37
  Top 0.305: R37.1 arc-90 17.03,78.38 JP1.1 | D1.1 19.02,79.32 arc-90 JP1.1 | R36.1 19.96,76.95 JP1.1
N$40
  Top 0.305: JP2.1 arc-90 23.52,79.25 28.7,79.25 arc90 D2.1 | JP2.1 R39.2 | JP2.1 arc45 23.23,78.15 R38.1
OR1
  Bottom 0.305: OR.12 25.53,12.04 arc-90 23.47,9.98 arc90 23.11,9.63 23.11,9.27 arc-90 22.73,8.89 22.23,8.89 arc90 21.72,8.38 OR.6
OR2  (via drill 0.35)
  Top 0.305: v20.83,15.09 v26.34,15.09
  Bottom 0.305: OR.8 20.45,14.71 arc-90 v20.83,15.09 | v26.34,15.09 arc-90 26.8,14.63 OR.13
Q0  (via drill 0.35)
  Top 0.305: v38.1,24.05 arc90 36.85,25.3 D-TYPE.2 | v38.1,24.05 arc90 38.71,23.44 39.55,23.44 arc90 39.93,23.82 39.93,25.43 arc90 39.06,26.29 36.73,26.29 arc-90 D-TYPE.4 | LED_Q0.2 arc90 46.2,22.23 39.93,22.23 arc-90 v38.1,24.05
  Route15 0.305: v45.72,9.75 38.46,17.01 arc-45 v38.1,17.88
  Bottom 0.305: AND2.4 46.1,8.83 arc45 v45.72,9.75 | v38.1,17.88 v38.1,24.05
Q0!Q1  (via drill 0.35)
  Top 0.305: v43.43,5.44 arc-90 42.44,4.45 24.59,4.45 arc-90 24.26,4.78 v24.26,4.88
  Bottom 0.305: AND2.6 43.43,7.17 v43.43,5.44 | OR.4 v24.26,4.88 | v24.26,4.88 arc90 v24.26,4.88
Q1  (via drill 0.35)
  Top 0.305: INVERTER.5 25.5,7.32 25.5,8.71 arc-90 v25.91,9.12 | v50.04,14.96 50.04,12.85 arc-90 AND1.1 | v37.29,20.42 40.11,20.42 arc90 v40.44,20.75 | v40.44,26.29 arc90 39.93,26.8 D-TYPE.5 | v40.44,26.29 40.44,25.32 arc90 v42.8,22.96 45.08,22.96 arc90 LED_Q1.2 | v40.44,26.29 arc90 41.15,25.58 41.5,25.58 arc90 42.29,26.36 42.29,26.49 arc90 40.98,27.8 D-TYPE.7
  Route2 0.305: v25.91,9.12 26.59,9.12 arc45 28.5,9.91 v36.35,17.75
  Route15 0.305: v50.04,14.96 arc45 49,17.48 44.01,22.46 arc45 v42.8,22.96
  Bottom 0.305: v36.35,17.75 36.71,18.11 arc45 36.96,18.72 36.96,20.09 arc-90 v37.29,20.42 | v40.44,20.75 v40.44,26.29 | v40.44,26.29 arc-90 v40.44,26.29
Q1!Q3  (via drill 0.35)
  Top 0.305: AND1.3 v47.37,11.02 | v40.89,6.45 v29.97,6.45
  Route2 0.305: v40.89,6.45 41.2,6.45 arc45 45.41,8.19 46.76,9.55 arc45 v47.37,11.02
  Bottom 0.305: OR.1 arc90 28.91,6.45 v29.97,6.45
Q2  (via drill 0.35)
  Top 0.305: D-TYPE.6 40.39,27.3 arc-90 v41.4,26.29 | D-TYPE.8 39.6,28.3 arc90 39.62,28.32 arc-90 39.88,28.57 v41.23,28.57 46.38,28.57 arc90 LED_Q2.2
  Bottom 0.305: AND2.9 43.56,14.71 arc90 42.67,15.6 42.59,15.6 arc-90 41.4,16.78 v41.4,26.29 41.4,28.4 arc90 v41.23,28.57
Q2!Q3  (via drill 0.35)
  Top 0.305: v31.75,11.4 arc-45 32.18,11.58 39.8,11.58 arc90 v40.26,12.04
  Route2 0.305: v23.24,5.56 24.26,5.56 arc45 27.07,6.73 v31.75,11.4
  Bottom 0.305: OR.5 22.99,5.82 arc90 v23.24,5.56 | v40.26,12.04 arc-90 40.94,12.72 AND2.8
Q3  (via drill 0.35)
  Top 0.305: INVERTER.9 26.8,11.36 arc45 v27.3,10.13 | LED_Q3.2 43.69,34.01 arc90 v43.05,33.38 | LED_A0.1 arc90 38.82,44.65 40.41,44.65 arc-90 v41.02,44.04 | v35.48,48.39 39.13,48.39 arc-45 v39.5,48.23 | MUX+.11 32.57,41.82 29.8,41.82 arc-45 v29.34,42.01 | v35.61,20.45 30.1,20.45 arc-90 v29.82,20.73 | v29.82,27.64 arc-90 30.48,28.3 D-TYPE.13 | D-TYPE.9 37.51,28.8 | 37.51,28.8 arc90 37.82,29.11 37.82,29.84 arc90 37.16,30.5 v30.48,30.5 30.15,30.5 arc-90 v28.02,32.64 | v43.05,29.95 arc-90 42.42,29.31 39.6,29.31 arc90 39.37,29.08 arc-90 39.09,28.8 37.51,28.8
  Route2 0.305: v35.38,18.03 arc45 35.36,17.99 27.65,10.28 arc-45 v27.3,10.13 | v35.48,48.39 arc45 34.88,48.14 29.62,42.88 arc45 29.34,42.19 v29.34,42.01
  Bottom 0.305: v35.38,18.03 35.64,18.29 arc45 35.99,19.14 35.99,20.07 arc90 v35.61,20.45 | v43.05,33.38 v43.05,29.95 | MUX-.11 arc90 38.58,41.78 39.85,41.78 arc90 41.02,42.95 v41.02,44.04 41.02,45.08 arc45 39.87,47.87 v39.5,48.23 | v29.34,42.01 29.34,40.5 arc-45 28.62,38.77 28.25,38.39 arc45 28.02,37.84 v28.02,32.64 | v29.82,20.73 v29.82,27.64 29.82,29.84 arc-90 v30.48,30.5
Q4  (via drill 0.35)
  Top 0.305: v47.37,17.58 arc90 46.1,18.85 v38.86,18.85 | D-TYPE.12 29.82,28.8 arc90 29.44,28.42 arc-90 29.13,28.12 28.3,28.12 arc90 27.69,27.51 arc45 27.9,26.99 v28.15,26.75 arc45 28.82,26.47 29.36,26.47 arc45 29.97,26.72 30.73,27.48 arc-45 31.5,27.8 D-TYPE.14 | v26.8,31.7 arc90 24.49,34.01 LED_Q4.2
  Route15 0.305: v38.86,18.85 37.1,18.85 arc-45 35.3,19.59 32.02,22.87 arc-45 31.83,23.34 31.83,23.44 arc90 31.11,24.16 31,24.16 arc-45 30.55,24.34 v28.15,26.75
  Bottom 0.305: AND2.12 v47.37,17.58 | v28.15,26.75 27.54,27.35 arc-45 26.8,29.15 v26.8,31.7
Q4!Q5  (via drill 0.35)
  Top 0.305: v31.37,7.59 v39.37,7.59
  Route2 0.305: v45.97,14.2 v39.37,7.59
  Route15 0.305: v22.1,15.98 arc-45 23.4,15.44 31.24,7.59 v31.37,7.59
  Bottom 0.305: AND2.11 46.1,14.07 arc90 v45.97,14.2 | OR.9 21.72,15.6 arc-90 v22.1,15.98
Q5  (via drill 0.35)
  Top 0.305: INVERTER.11 24.26,10.11 arc45 v24.51,9.5 | AND1.4 46.1,11.4 arc-90 v45.85,11.15 | v41.53,15.09 41.45,15.01 v35.69,15.01 | v30.71,23.47 arc90 31.04,23.14 v33.88,23.14 | D-TYPE.15 31.63,27.3 arc90 v30.73,26.4 arc-90 30.18,25.86 v27.25,25.86 | D-TYPE.17 33.16,26.3 arc90 v32.84,25.98 | LED_Q5.2 24.95,29.57 arc-90 v26.23,28.29
  Route2 0.305: v24.51,9.5 arc45 25.29,9.82 v33.5,18.03
  Route15 0.305: v45.85,11.15 45.8,11.15 42.09,14.85 arc45 v41.53,15.09 | v32.23,24.51 arc-90 30.73,26.01 v30.73,26.4
  Bottom 0.305: v35.69,15.01 arc-90 34.34,16.36 34.34,17.2 arc90 v33.5,18.03 arc45 33.88,18.95 v33.88,23.14 | v30.71,23.47 30.71,26.38 arc-90 v30.73,26.4 | v32.84,25.98 32.84,25.12 arc-90 v32.23,24.51 | v26.23,28.29 26.23,26.88 arc90 v27.25,25.86
Q5!Q7  (via drill 0.35)
  Top 0.305: AND1.6 43.81,12.47 v43.81,10.39 | v36.68,5.71 v27.18,5.71
  Route2 0.305: v36.68,5.71 37.17,5.71 arc45 40.53,7.11 v43.81,10.39
  Bottom 0.305: OR.2 26.8,6.1 arc90 v27.18,5.71
Q6  (via drill 0.35)
  Top 0.305: D-TYPE.16 32.41,26.8 arc90 v31.55,25.93 | v31.55,25.93 31.55,25.63 arc90 31.9,25.27 32.8,25.27 arc45 33.48,25.55 arc-45 34.08,25.8 D-TYPE.18 | LED_Q6.2 arc90 23.6,24.77 30.56,24.77 arc90 31.55,25.76 v31.55,25.93
  Route2 0.305: v23.47,10.97 arc45 25.03,11.62 v30.71,17.3
  Bottom 0.305: OR.10 22.99,11.33 arc90 23.34,10.97 v23.47,10.97 | v30.71,17.3 arc45 31.55,19.32 v31.55,25.93
Q7  (via drill 0.35)
  Top 0.305: v22.35,10.01 arc-90 21.72,10.64 INVERTER.13 | v33.2,23.9 33.2,24.15 arc-90 D-TYPE.19 | LED_Q7.2 arc90 25.07,19.1 v32.23,19.1
  Route2 0.305: v22.35,10.01 23.1,10.01 arc45 25.46,10.99 v32.49,18.01
  Bottom 0.305: v32.49,18.01 arc45 33.2,19.73 33.2,20.07 | v33.2,23.9 33.2,21.03 33.2,20.07 | v32.23,19.1 arc90 33.2,20.07
SCK  (via drill 0.35)
  Top 0.305: COLD_JUNCTION.5 38.4,53.8 arc90 40.91,51.28 LED_SCK.1 43.05,50.78 arc90 44.58,49.25 49.66,49.25 arc90 TEST_SCK.1 | v35.43,52.86 36.05,53.47 arc-45 37.2,53.95 COLD_JUNCTION.5 | SPI.3 27.97,52.17 arc-45 28.57,51.92 arc45 28.94,51.77 30.83,51.77 arc-45 31.14,51.64 arc45 31.51,51.49 v31.7,51.49 | COLD_JUNCTION.5 40.01,53.95 arc90 v40.26,54.2 | v14.53,77.7 arc90 15.26,76.97 R37.2
  Route2 0.305: v31.7,51.49 33.55,51.49 arc45 34.42,51.84 v35.43,52.86
  Route15 0.305: v40.26,54.2 arc45 40.82,55.55 40.82,72.05 arc45 40.07,73.84 39.67,74.24 arc45 29.5,78.46 26.95,78.46 arc-90 26.77,78.64 arc90 26.31,79.1 24.71,79.1 arc-90 24.23,79.58 24.23,79.86 arc90 22.96,81.13 15.04,81.13 arc90 14.53,80.62 v14.53,77.7
T0+  (via drill 0.35)
  Top 0.305: CONNECTOR_0.1 5.08,65.51 arc90 D10.1 9.79,65.76 arc-45 11.59,65.02 v13.77,62.84 | v30.1,40.62 arc90 30.4,40.31 31.22,40.31 arc90 31.29,40.39 arc-90 31.45,40.54 MUX+.13
  Route15 0.305: v13.77,62.84 19.15,57.46 arc-45 19.66,56.23 19.66,51.87 arc90 22.53,49 25.81,49 arc-45 26.24,48.82 arc45 26.91,48.54 27.73,48.54 arc45 27.79,48.56 arc-45 28.79,48.15 v29.59,47.35
  Bottom 0.305: v29.59,47.35 arc-45 30.1,46.12 v30.1,40.62
T0-  (via drill 0.35)
  Top 0.305: D18.1 arc90 5.08,48.36 | 5.08,48.36 CONNECTOR_0.2 | v25.15,48.23 24.49,48.23 24.33,48.23 5.38,48.23 arc-45 5.08,48.36
  Route15 0.305: v36.58,40.49 34.97,40.49 arc-45 33.85,40.95 27.31,47.49 arc45 25.52,48.23 v25.15,48.23
  Bottom 0.305: v36.58,40.49 38.39,40.49 arc-45 MUX-.13
T1+
  Top 0.305: CONNECTOR_1.1 5.08,45.62 arc90 D11.1 10.34,46.02 arc-90 12.88,43.48 12.88,42.34 arc90 15.42,39.8 32.38,39.8 arc45 MUX+.14
T1-  (via drill 0.35)
  Top 0.305: CONNECTOR_1.2 5.08,28.52 arc-90 D19.1 arc90 4.88,28.19 v17.37,28.19
  Route2 0.305: v17.37,28.19 24.19,28.19 arc45 25.87,28.89 v35.18,38.2
  Bottom 0.305: v35.18,38.2 36.28,39.3 arc-45 37.71,39.89 MUX-.14
T2+  (via drill 0.35)
  Top 0.305: CONNECTOR_2.1 5.08,26.04 arc90 D9.1 14.19,26.31 arc45 v14.68,26.52 | v25.88,37.72 26.31,38.14 arc-45 28.96,39.24 MUX+.15
  Route2 0.305: v14.68,26.52 16.32,28.16 arc45 16.66,28.98 arc-45 17.22,30.33 21.85,34.95 arc-45 22.76,35.33 arc45 24.02,35.85 v25.88,37.72
T2-  (via drill 0.35)
  Top 0.305: CONNECTOR_2.2 5.08,8.77 arc-90 D17.1 v11.02,8.64
  Route2 0.305: v36.52,33.68 arc-45 36.2,32.9 12.59,9.28 arc-45 v11.02,8.64
  Bottom 0.305: v36.52,33.68 36.52,38.53 arc-90 37.16,39.17 38.45,39.17 arc90 MUX-.15
T3+  (via drill 0.35)
  Top 0.305: CONNECTOR_3.1 5.08,85.47 arc90 D7.1 9.79,85.72 arc45 11.59,86.47 13,87.88 arc-45 14.79,88.62 33.4,88.62 arc-90 v34.72,87.3 | MUX+.12 33.27,41.19 arc-45 33.93,40.92 arc45 34.61,40.64 arc45 35.19,40.88 35.3,40.99 arc-45 35.48,41.42 v36.07,42.01
  Bottom 0.305: v36.07,42.01 36.07,42.81 arc45 35.92,43.18 35.9,43.2 arc45 35.2,43.48 arc-90 34.72,43.97 v34.72,87.3
T3-  (via drill 0.35)
  Top 0.305: CONNECTOR_3.2 5.08,68.07 arc-90 D15.1 v10.08,67.69
  Route15 0.305: v36.83,42.77 36.83,42.81 arc45 36.09,44.61 30,50.69 arc45 28.21,51.44 24.79,51.44 arc45 23.44,50.88 23.02,50.45 arc-45 22.76,50.34 22.34,50.34 arc-45 21.97,50.49 21.78,50.69 arc-45 21.57,51.21 arc45 21.3,51.86 20.94,52.22 arc-45 20.19,54.01 20.19,56.63 arc45 19.45,58.43 10.26,67.62 arc45 v10.08,67.69
  Bottom 0.305: v36.83,42.77 36.83,41.53 arc90 37.24,41.12 38.35,41.12 arc45 MUX-.12
T4+  (via drill 0.35)
  Top 0.305: MUX+.1 39,38.59 arc-90 40.16,37.44 arc90 40.77,36.83 44.04,36.83 arc-90 v44.32,36.55 | CONNECTOR_4.1 62.74,8.89 arc90 D8.1 v55.96,8.64
  Route15 0.305: v44.32,20.55 44.36,20.51 arc45 45.08,18.77 54.7,9.16 arc45 v55.96,8.64
  Bottom 0.305: v44.32,36.55 v44.32,20.55
T4-  (via drill 0.35)
  Top 0.305: v54.23,25.76 61.64,25.76 arc45 D16.1 arc45 62.74,25.71 CONNECTOR_4.2
  Route15 0.305: v32.13,36.63 32.16,36.63 42.74,26.05 arc45 43.44,25.76 v54.23,25.76
  Bottom 0.305: v32.13,36.63 31.42,37.34 31.42,37.41 arc-90 MUX-.1
T5+  (via drill 0.35)
  Top 0.305: CONNECTOR_5.1 62.74,67.94 arc90 D4.1 58.7,67.69 arc45 58.69,67.7 v55.49,67.7 | v41.91,42.01 arc-90 41.12,41.22 38.58,41.22 arc45 MUX+.5
  Route2 0.305: v40.77,50.52 40.77,51.74 arc-45 43.17,57.55 52.58,66.95 arc-45 54.37,67.7 v55.49,67.7
  Bottom 0.305: v41.91,42.01 41.91,47.19 arc90 41.45,47.65 arc-90 40.77,48.34 v40.77,50.52
T5-  (via drill 0.35)
  Top 0.305: CONNECTOR_5.2 62.74,85.22 arc-90 D12.1 v55.14,85.47
  Route2 0.305: v55.14,85.47 55.13,85.47 arc45 53.07,84.62 30.93,62.48 arc45 v30.56,61.57
  Bottom 0.305: MUX-.5 31.32,41.19 arc-90 30.56,41.96 30.56,46.41 arc-45 30.91,47.27 32.31,48.66 arc45 32.72,49.65 32.72,50.91 arc45 32.26,52.02 32.18,52.1 arc45 31.57,52.35 31.5,52.35 arc-90 30.99,52.86 30.99,53.23 arc45 30.84,53.59 arc-45 30.56,54.27 v30.56,61.57
T6+  (via drill 0.35)
  Top 0.305: v40.77,38.71 arc45 39.48,39.24 MUX+.2 | CONNECTOR_6.1 62.74,28.85 arc45 D5.1 57.06,28.25 arc-45 55.26,28.99 53.12,31.13 arc45 51.32,31.88 v48.08,31.88
  Route15 0.305: v40.77,38.71 40.79,38.71 47.3,32.2 arc45 v48.08,31.88
T6-  (via drill 0.35)
  Top 0.305: v54.66,44.53 arc-45 56.87,45.44 61.58,45.44 arc45 D13.1 arc45 62.74,45.42 CONNECTOR_6.2
  Route2 0.305: v34.29,39.73 48.81,39.73 arc45 50.6,40.47 v54.66,44.53
  Bottom 0.305: MUX-.2 33.48,39.24 arc45 33.6,39.29 33.86,39.55 arc-45 v34.29,39.73
T7+  (via drill 0.35)
  Top 0.305: MUX+.4 v41.27,40.54 | CONNECTOR_7.1 62.74,48.56 arc45 D6.1 arc45 62.38,48.21 v53.14,48.21
  Route2 0.305: v41.27,40.54 arc45 42.1,40.88 48.68,47.47 arc-45 50.48,48.21 v53.14,48.21
T7-  (via drill 0.35)
  Top 0.305: CONNECTOR_7.2 62.74,65.16 arc-45 D14.1 57.58,65.76 arc90 v55.62,63.8
  Route2 0.305: v34.67,41.38 arc-45 35.14,42.5 54.63,62 54.79,62.16 55.05,62.41 arc45 v55.62,63.8
  Bottom 0.305: MUX-.4 34.21,40.54 arc45 34.44,40.64 arc45 34.67,41.19 v34.67,41.38
V+  (via drill 0.35)
  Top 0.305: v28.04,47.78 arc-90 28.63,47.19 28.63,47.02 arc-90 27.95,46.34 PS_3.3V.3 24.3,46.34 arc-45 23.16,46.82 22.84,47.14 arc45 21.91,47.52 v15.01,47.52
  Bottom 0.305: v28.04,47.78 arc90 26.92,46.66 C6.2 | v15.01,47.52 arc-90 13.01,49.53 13.01,86.03 arc-90 16.89,89.92 38.63,89.92 arc-90 41.83,86.72 41.83,76.76 arc45 42.41,75.36 C3.2 46.3,71.96 PS_12V.6
V-  (via drill 0.35)
  Top 0.305: v54.23,47.47 arc-45 54.14,47.26 52.88,46 | 52.88,46 51.87,44.99 arc-45 50.51,44.42 PS_-3.3V.2 | v49.4,45.31 51.23,45.31 arc45 52.88,46
  Bottom 0.305: v49.4,45.31 48.1,45.31 arc90 C5.1 | v54.23,47.47 arc45 54.94,49.19 54.94,66.65 arc45 53.94,69.06 51.58,71.45 C4.2 arc45 51.38,71.72 PS_12V.8
VCC  (via drill 0.35)
  Top 0.305: LED_3.3V.2 arc90 18.34,42.09 19.68,42.09 arc90 21.53,43.93 PS_3.3V.4 | PS_3.3V.2 26.73,44.34 arc90 25.81,45.26 25.73,45.26 arc90 v24.64,44.17 | PS_3.3V.2 v28.7,44.04 | MUX+.6 37.68,41.84 arc45 36.85,41.5 36.67,41.32 arc-45 36.32,41.17 36.06,41.17 arc45 35.94,41.12 arc45 35.89,41 35.89,40.57 arc-45 35.58,39.83 34.75,38.99 arc-45 33.79,38.59 MUX+.16 32,37.99 arc-45 31.39,37.74 30.51,37.74 arc-45 30.02,37.95 arc-45 29.84,38.38 v29.84,38.46 | SPI.5 SPI.6 SPI.7 SPI.8 24.9,53.48 arc-90 v26.24,54.81 | PS_3.3V.4 21.53,45.86 arc-90 v21.95,46.28 | COLD_JUNCTION.4 arc-90 33.35,53.57 33.35,53.37 arc-90 32.92,52.93 v32.84,52.93 34.24,52.93 arc-90 34.67,52.5 arc90 35.26,51.92 v37.47,51.92 | SPI.12 arc-90 23.46,50.47 22.61,50.47 arc-90 21.89,51.18 arc90 21.16,51.92 v18.8,51.92 | PS_3.3V.2 arc-90 25.99,43.31 22.27,43.31 arc-90 PS_3.3V.4 | v19.36,46.23 arc-90 21.53,44.05 PS_3.3V.4 | v26.75,49.33 arc-90 26.4,49.67 SPI.16 | PS_-3.3V.3 47.37,46.58 arc90 v45.97,47.98 42.65,47.98 arc-90 42.37,48.26 arc90 41.66,48.97 39.24,48.97 arc-90 v38.38,49.84 | INVERTER.14 arc-90 19.81,13.36 19.81,15.72 arc-90 21.39,17.3 24.56,17.3 arc90 v25.53,18.26 | v52.32,10.13 52.32,9.71 arc-90 AND1.14 50.96,7.3 arc-90 C16.2 | v27.38,22.33 34.34,22.33 arc90 35.31,23.29 35.31,24.84 arc90 D-TYPE.20 | R6.1 18.23,10.51 arc90 INVERTER.14 | C13.2 arc90 19.35,12.72 INVERTER.14
  Route2 0.305: v32.84,52.93 32.04,52.93 arc45 31.37,52.65 arc45 30.99,51.73 30.99,49.46 arc-90 30.22,48.69 29.92,48.69 arc90 28.83,47.6 28.83,47.37 arc-90 27.74,46.28 v21.95,46.28 | v25.53,30.84 arc-45 26.26,32.61 28.63,34.98 arc45 29.23,36.45 v29.23,37.31 | v26.24,54.81 25.58,54.81 arc90 24.71,53.95 24.71,52.05 arc-90 23.44,50.77 22.12,50.77 arc-90 21.46,51.44 arc90 20.98,51.92 v18.8,51.92
  Route15 0.305: v28.7,44.04 28.86,44.04 arc-45 29.59,43.74 29.61,43.72 arc-45 30.35,41.92 30.35,41.83 arc45 30.6,41.23 30.76,41.07 arc-45 31.01,40.46 31.01,40.34 arc-45 30.82,39.86 30.15,39.19 arc45 v29.84,38.46 | v48.64,10.64 arc-90 48.08,11.2 48.08,13.8 arc45 47.37,15.52 arc45 46.45,15.9 46.08,15.9 arc-45 44.77,16.44 43.93,17.28 arc-45 43.66,17.93 43.66,19.04 arc45 43.33,19.84 42.78,20.39 arc-45 42.04,22.18 42.04,22.67 arc45 41.29,24.47 29.79,35.97 arc-45 v29.23,37.31 29.47,37.55 arc45 v29.84,38.46 | v37.59,37.19 32.89,37.19 arc-90 v32.77,37.31 30.39,37.31 arc-45 30.15,37.41 arc-45 29.84,38.15 v29.84,38.46
  Bottom 0.305: v24.64,44.17 24.64,43.92 arc90 25.22,43.33 26.43,43.33 arc90 C7.2 27.54,43.83 arc90 27.86,44.15 27.86,44.2 arc-90 28.25,44.58 arc90 28.88,45.21 28.88,48.11 arc90 28.63,48.36 arc-90 28.32,48.67 R5.1 arc-90 27.8,49.33 v26.75,49.33 | C8.1 25.21,54.12 arc-90 25.91,54.81 v26.24,54.81 arc-90 27.18,53.87 R4.2 | v18.8,51.92 18.77,51.92 arc90 17.93,51.08 17.93,47.65 arc90 v19.36,46.23 | R8.1 44.57,56.11 arc-90 R16.1 arc-90 44.57,55.85 R13.1 44.57,49.38 arc90 v45.97,47.98 | v37.47,51.92 arc-90 38.38,51 v38.38,49.84 | v25.53,18.26 25.53,19.91 | 25.53,19.91 25.53,24.18 | 25.53,24.18 v25.53,30.84 | v52.32,10.13 52.32,10.31 arc90 AND2.14 | v48.64,10.64 arc90 49.91,11.91 AND2.14 | v32.77,37.31 arc45 33.46,37.6 34.75,38.89 arc45 35.48,40.67 35.48,41.43 arc45 35.31,41.84 35.26,41.9 arc45 34.8,42.09 34.72,42.09 arc45 34.16,41.86 arc-45 34.12,41.84 MUX-.6 | MUX-.16 38.52,38.12 arc-90 v37.59,37.19 | 25.53,19.91 arc90 27.05,18.39 arc-90 28.07,17.37 OR.14 arc-90 28.69,13.35 C14.2 | 25.53,24.18 arc90 v27.38,22.33 | v32.84,52.93 32.79,52.93 arc-90 32.08,53.65 arc-90 32.83,54.39 C1.2 | C15.2 arc-90 50.91,12.72 AND2.14
VDD
  Top 0.305: LED_12V.2 38.23,75.21 arc-90 PS_12V.2 36.14,78.21 arc90 33.66,80.7 21.39,80.7 arc-90 21.06,81.02 D3.1 20.95,83.29 JP3.1

## Text on the board
tPlace: BAJA SAE 2021-2022 / Thermocouple Amplifier / Designed By Ethan Edwards / WAGMI
tNames: C:/Users/forre/Pictures/Screenshot 2022-04-25 140747.bmp